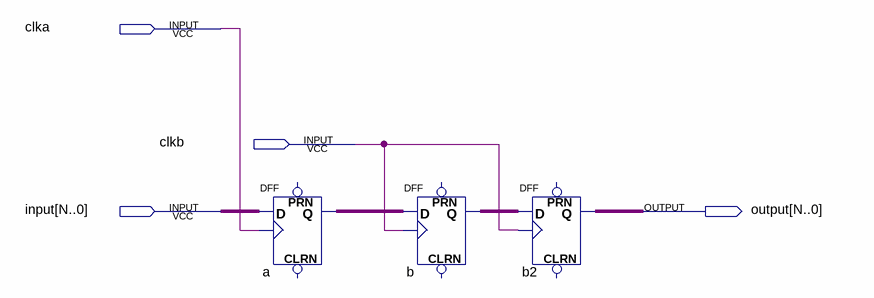
[diagram p0: schematic sheet]
// Quartus schematic FFSynchronizer.bdf as structural Verilog: 3 symbols, 4 pins
module FFSynchronizer (
  input  clka,
  input  clkb,
  input  \input[N..0] ,
  output \output[N..0] 
);

  wire a_q, b_q;

  DFF a (.CLK(clka), .D(\input[N..0] ), .Q(a_q));  // open: CLRN, PRN
  DFF b (.CLK(clkb), .D(a_q), .Q(b_q));  // open: CLRN, PRN
  DFF b2 (.CLK(clkb), .D(b_q), .Q(\output[N..0] ));  // open: CLRN, PRN
endmodule
